# Altium schematic sheet Switch mode power supply.SchDoc
size A4; SheetNumber: 3; SheetTotal: 4
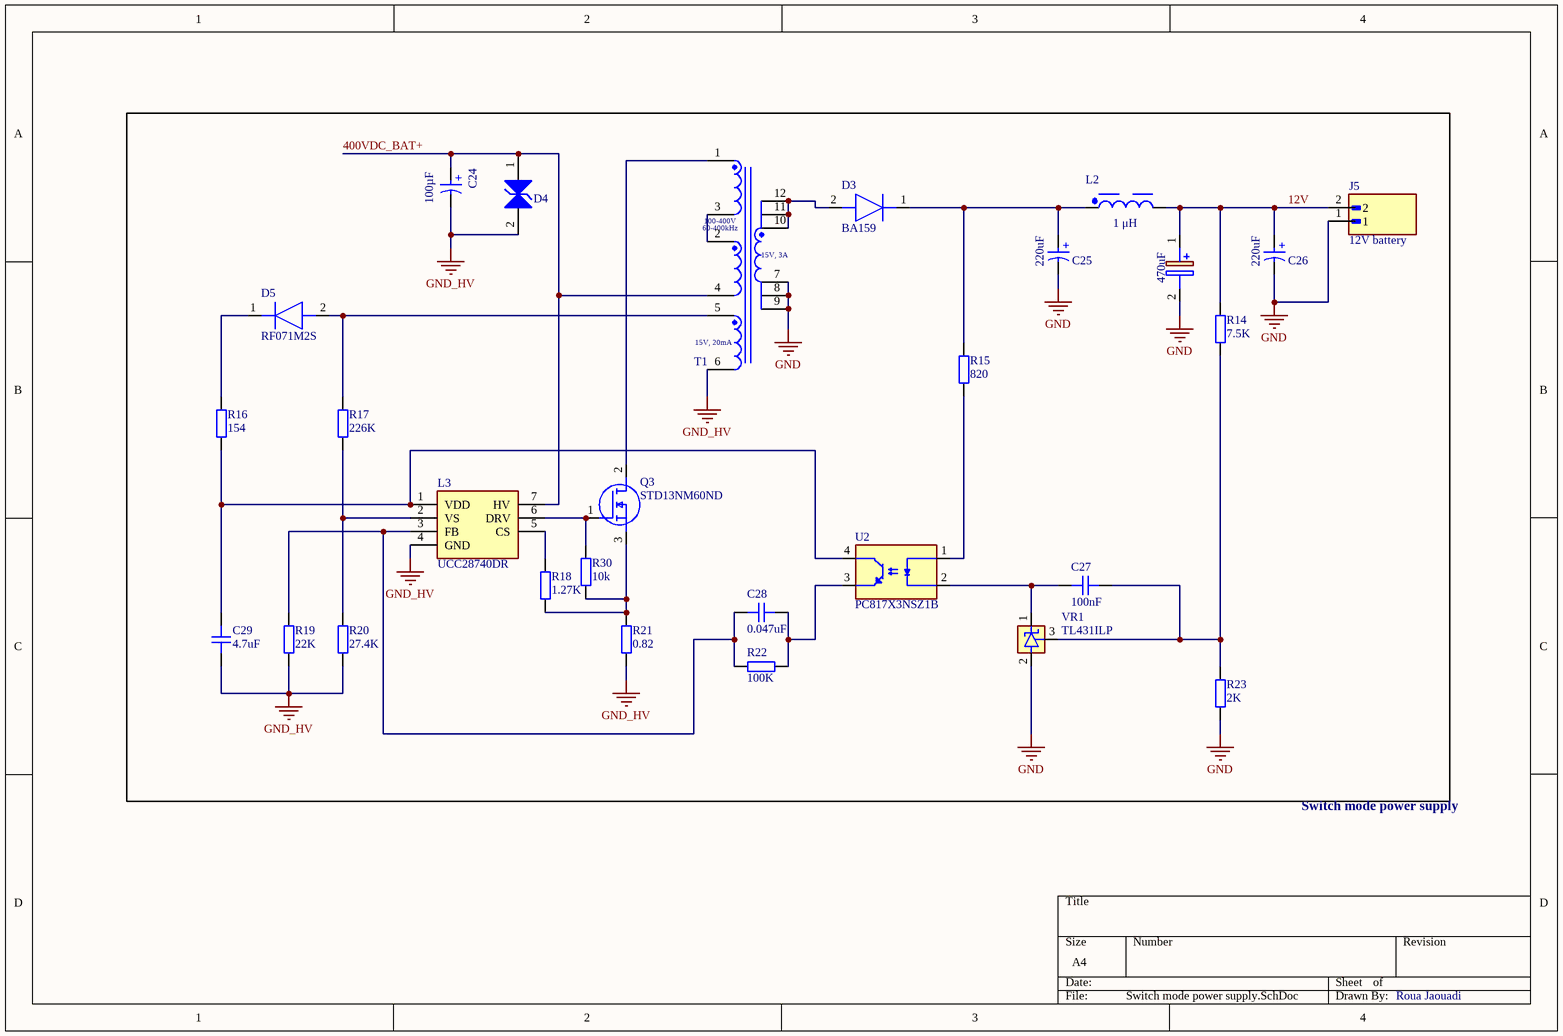
[diagram p0: Switch mode power supply.SchDoc]

## Parts
470uF  UVR1C471MPD  [CAPPRD350W60D825H1300]  (value not drawn)
C24  100µF  [WCAP-AT1H_D16H35.5]
C25  220uF  [WCAP-ATG8_D6.3H11]
C26  220uF  [WCAP-ATG8_D6.3H11]
C27  100nF  [CAP_1206]
C28  0.047uF  [CAP_1206]
C29  4.7uF  [CAP_1206]
D3  BA159  [DIOAD1405W86L465D235]
D4  600W, 5VDC  [WE-TVSP_DO-214AA_Bidirectional]  (value not drawn)
D5  RF071M2S  [RF071M2S]
J5  12V battery  [JST_S2B-XH-A(LF)(SN)]
L2  1 μH  [WE-LHMI_1040]
L3  UCC28740DR  [D(R-PDSO-G7)]
Q3  STD13NM60ND  [STD13NM60ND]
R14  7.5K  [RES_0603]
R15  820  [RES_0603]
R16  154  [RES_0603]
R17  226K  [RES_0603]
R18  1.27K  [RES_0603]
R19  22K  [RES_0603]
R20  27.4K  [RES_0603]
R21  0.82  [RES_0603]
R22  100K  [RES_0603]
R23  2K  [RES_0603]
R30  10k  [RES_0603]
T1  100-400Vin, Uo1 = 15V/3A  [WE-FB_EFD25]  (value not drawn)
U2  PC817X3NSZ1B  [DIP762W50P254L495H455Q4]
VR1  TL431ILP  [VREG_TL431ILP]

## Nets
GND: 470uF.2(-) C25.2(N) C26.2(N) J5.1 R23.1 T1.7 T1.8 T1.9 VR1.2(ANODE)
GND_HV: C24.2(N) C29.1 D4.2 L3.4(GND) R19.1 R20.1 R21.1 T1.6
12V: 470uF.1(+) C26.1(P) J5.2 L2.2 R14.2
400VDC_BAT+: C24.1(P) D4.1 L3.7(HV) T1.4
NetC25_1: C25.1(P) D3.1(K) L2.1 R15.2
NetC27_1: C27.1 R14.1 R23.2 VR1.3(REF)
NetC27_2: C27.2 U2.2(CATHODE) VR1.1(CATHODE)
NetC28_1: C28.1 R22.1 U2.3(EMITTER)
NetC28_2: C28.2 L3.3(FB) R19.2 R22.2
NetC29_2: C29.2 L3.1(VDD) R16.1 U2.4(COLLECTOR)
NetD3_2: D3.2(A) T1.10 T1.11 T1.12
NetD5_1: D5.1(K) R16.2
NetD5_2: D5.2(A) R17.2 T1.5
NetL3_2: L3.2(VS) R17.1 R20.2
NetL3_5: L3.5(CS) R18.1
NetL3_6: L3.6(DRV) Q3.1(G) R30.1
NetQ3_2: Q3.2(D) T1.1
NetQ3_3: Q3.3(S) R18.2 R21.2 R30.2
NetR15_1: R15.1 U2.1(ANODE)
NetT1_2: T1.2 T1.3

## Notes on the sheet
- Switch mode power supply
- Roua Jaouadi
- (in symbol 750311771) 100-400V; 60-400kHz; 15V, 3A; 15V, 20mA
- (in symbol 860010273009) +
- (in symbol 860241480001) +

## Library data of the parts
470uF = UVR1C471MPD: Capacitor Polarised; Manufacturer_Name: Nichicon; Datasheet Link: https://www.nichicon.co.jp/english/series_items/catalog_pdf/e-uvr.pdf; Height: 13mm; Manufacturer_Part_Number: UVR1C471MPD; Arrow Part Number: UVR1C471MPD; Arrow Price/Stock: https://www.arrow.com/en/products/uvr1c471mpd/nichicon
C24 = 860241480001: WCAP-AT1H Aluminum Electrolytic Capacitor, Radial, D16 x H35.5mm, 100µF, 450V; Manufacturer: Wurth Elektronik; Capacitance Tolerance: +/-20%; Dissipation Factor: 17%; Endurance: 5000h; Leakage Current: 1900µA; Ripple Current: 610mA; Technical Reference: ATJK355101M450DSPADE000; Manufacturer Part Number: 860241480001; Category: Aluminum Electrolytic Capacitors; Match Code: WCAP-AT1H; ComponentLink1Description: Website Link; ComponentLink1URL: https://www.we-online.com/redexpert/article/860241480001?ad; ComponentLink2Description: Datasheet Link; ComponentLink2URL: https://www.we-online.com/redexpert/spec/860241480001?ad; Mount: Through Hole; Min Operating Temperature: -25°C; Max Operating Temperature: 105°C; Packaging: Ammo Pack; Case/Size Code: D16 x H35.5mm; Height: 35.5mm; Diameter: 16mm; Capacitance: 100µF; Rated Voltage (DC): 450V
C25 C26 = 860010273009: WCAP-ATG8 Aluminum Electrolytic Capacitor, Radial, THT, D6.3 x H11mm, 220uF, 10V; Manufacturer: Wurth Elektronik; Capacitance Tolerance: +/-20%; Dissipation Factor: 19%; Endurance: 2000h; Leakage Current: 22uA; Ripple Current: 294mA; Technical Reference: ATBD110221M010DSPA4B000; Manufacturer Part Number: 860010273009; Category: Aluminum Electrolytic Capacitors; Match Code: WCAP-ATG8; ComponentLink1Description: Website Link; ComponentLink1URL: https://www.we-online.com/redexpert/article/860010273009?ad; ComponentLink2Description: Datasheet Link; ComponentLink2URL: https://www.we-online.com/redexpert/spec/860010273009?ad; Mount: Through Hole; Operating Temperature Max: 85°C; Operating Temperature Min: -40°C; Packaging: Ammo Pack; Height: 11mm; Diameter: 6.3mm; Capacitance: 220uF; Rated Voltage (DC): 10V
C27-C29 = CAP_1206: Capacitor SMD 1206; Manufacturer: *; Manufacturer Part Number: *; Distributor Link: *; LCSC: *; Rating: *; Dielectric: *
D3 = BA159: Diode; Manufacturer_Name: Rectron; Datasheet Link: http://pdf1.alldatasheet.com/datasheet-pdf/view/14648/PANJIT/BA159.html; Manufacturer_Part_Number: BA159; Mouser Part Number: 583-BA159; Mouser Price/Stock: https://www.mouser.co.uk/ProductDetail/Rectron/BA159?qs=7pEAo90IqNFl%2FmbY1pJmIw%3D%3D
D4 = 824521500: WE-TVSP SMT Power TVS Diode, DO-214AA, Bidirectional, 600W, 5VDC; Manufacturer: Wurth Elektronik; Clamping Voltage: 9.2V; Operating Voltage (DC): 5V; (Reverse) Breakdown Voltage: 6.7V; (Reverse) Peak Pulse Current: 65.3A; ComponentLink1Description: Website Link; ComponentLink1URL: https://www.we-online.com/redexpert/article/824521500?ad; ComponentLink2Description: Datasheet Link; ComponentLink2URL: https://www.we-online.com/redexpert/spec/824521500?ad; Manufacturer Part Number: 824521500; Category: Surge Protection; Match Code: WE-TVSP; Mount: Surface Mount; Operating Temperature Max: 150°C; Operating Temperature Min: -65°C; Packaging: Tape and Reel; Case/Size Code: DO-214AA; Length: 4.32mm; Width: 3.62mm; Height: 2.4mm; Polarity: Bidirectional; Power Dissipation: 600W
D5 = RF071M2S: Diode; Manufacturer_Name: ROHM Semiconductor; Datasheet Link: http://rohmfs.rohm.com/en/products/databook/datasheet-nrnd/discrete/diode/fast_recovery/rf071m2s.pdf; Height: 0.9mm; Manufacturer_Part_Number: RF071M2S; Mouser Part Number: N/A; Mouser Price/Stock: https://www.mouser.co.uk/ProductDetail/ROHM-Semiconductor/RF071M2S?qs=OfeFRKQgECgpuFmwKn2lvw%3D%3D
J5 = S2B-XH-A(LF)(SN): Connector Header Through Hole, Right Angle 2 position 0.098 (2.50mm); MF: JST Sales; SnapEDA_Link: https://www.snapeda.com/parts/S2B-XH-A(LF)(SN)/JST/view-part/?ref=snap; Package: None; Value: *; MP: S2B-XH-A(LF)(SN); Check_prices: https://www.snapeda.com/parts/S2B-XH-A(LF)(SN)/JST/view-part/?ref=eda
L2 = 74437368010: WE-LHMI SMT Power Inductor, size 1040, 1 μH, 21.3 A, 3.3 mΩ; Manufacturer: Wurth Elektronik; Case/Size Code: 1040; DC Resistance Max: 3.3 mΩ; Performance Rated Current: 21.3 A; Saturation Current @ 10%: 22.7 A; Saturation Current @ 30%: 48.3 A; Self Resonant Frequency: 45 MHz; Manufacturer Part Number: 74437368010; Category: Power Inductors; Match Code: WE-LHMI; ComponentLink1Description: Website Link; ComponentLink1URL: https://www.we-online.com/redexpert/article/74437368010?ad; ComponentLink2Description: Datasheet Link; ComponentLink2URL: https://www.we-online.com/redexpert/spec/74437368010?ad; Mount: Surface Mount; Min Operating Temperature: -40 °C; Max Operating Temperature: 125 °C; Packaging: Tape and Reel; Length: 11 mm; Width: 10 mm; Height: 3.8 mm; Inductance: 1 μH
L3 = UCC28740DR: Inductor; Manufacturer_Name: Texas Instruments; Datasheet Link: http://www.ti.com/lit/gpn/ucc28740; Manufacturer_Part_Number: UCC28740DR; Mouser Part Number: 595-UCC28740DR; Mouser Price/Stock: https://www.mouser.co.uk/ProductDetail/Texas-Instruments/UCC28740DR?qs=e1ok2LiJcmZNvNsbUBmieA%3D%3D; Arrow Part Number: UCC28740DR; Arrow Price/Stock: https://www.arrow.com/en/products/ucc28740dr/texas-instruments?region=nac
Q3 = STD13NM60ND: MOSFET (N-Channel); Manufacturer_Name: STMicroelectronics; Datasheet Link: https://mm.digikey.com/Volume0/opasdata/d220001/medias/docus/516/STx13NM60ND_DS.pdf; Height: 2.63mm; Manufacturer_Part_Number: STD13NM60ND; Mouser Part Number: 511-STD13NM60ND; Mouser Price/Stock: https://www.mouser.co.uk/ProductDetail/STMicroelectronics/STD13NM60ND?qs=DqCdCwOw4%2F6kZ%252B3qCIf%2FhQ%3D%3D; Arrow Part Number: STD13NM60ND; Arrow Price/Stock: https://www.arrow.com/en/products/std13nm60nd/stmicroelectronics?region=nac
R14-R23 R30 = RES_0603: Resistor SMD 0603; Manufacturer: *; Manufacturer Part Number: *; Distributor Link: *; LCSC: *
T1 = 750311771: WE-FB Flyback Transformer suitable for LT3748, SMT, EFD25, 100-400Vin, Uo1 = 15V/3A, 45W; Manufacturer: Wurth Elektronik; Auxiliary Voltage: 15V; Inductance: 500uH; Input Voltage: 100-400VDC; Insulation Test Voltage: 2000VAC; Leakage Inductance: 10uH; Output Current 1: 3A; Saturation Current: 2.5A; Turns Ratio: 3:3:1:1; Manufacturer Part Number: 750311771; Category: Transformers For DC-DC Converter; Match Code: WE-FB; ComponentLink1Description: Website Link; ComponentLink1URL: https://www.we-online.com/redexpert/article/750311771?ad; ComponentLink2Description: Datasheet Link; ComponentLink2URL: https://www.we-online.com/redexpert/spec/750311771?ad; Mount: Surface Mount; Operating Temperature Max: 125°C; Operating Temperature Min: -40°C; Packaging: Tape and Reel; Case/Size Code: EFD25; Length: 32.31mm; Width: 27.03mm; Height: 13.69mm; IC Reference: LT3748; Output Power: 45W; Output Voltage 1: 15V
U2 = PC817X3NSZ1B: Optoisolator Transistor Output - 1 Channel 4-DIP; MF: Sharp Microelectronics; SnapEDA_Link: https://www.snapeda.com/parts/PC817X3NSZ1B/Sharp+Microelectronics/view-part/?ref=snap; Price: None; Purchase-URL: https://pricing.snapeda.com/search/part/PC817X3NSZ1B/?ref=eda; Check_prices: https://www.snapeda.com/parts/PC817X3NSZ1B/Sharp+Microelectronics/view-part/?ref=eda; MP: PC817X3NSZ1B; Value: *; Availability: In Stock; Package: DIP-4 Sharp Microelectronics
VR1 = TL431ILP: Package: None; Price: None; Value: *; MP: TL431ILP; Availability: Unavailable